# Altium schematic sheet Pulse.schdoc
size 594 x 419 mm; Symbol: Drawing-Symbol_A4; Company: 嘉立创EDA; Version: V1.0; Page Size: A2; @Project Name: hackathon; @Update Date: 2026-08-20; @Create Date: 2026-08-20; Device: Drawing-Symbol_A4; @Board Name: Board1; @Page Name: P1; @Create Time: 20:05:00; @Page Count: 1; @Page No: 1; @Schematic Name: Schematic1; @Update Time: 20:05:00; @Assembly Variant: Basic; Border: 1; Title Block Position: 3; Size: A4; Width: 2338; Height: 1652; Region Start: 1; X Region Count: 6; Y Region Count: 4; Blade Width: 10
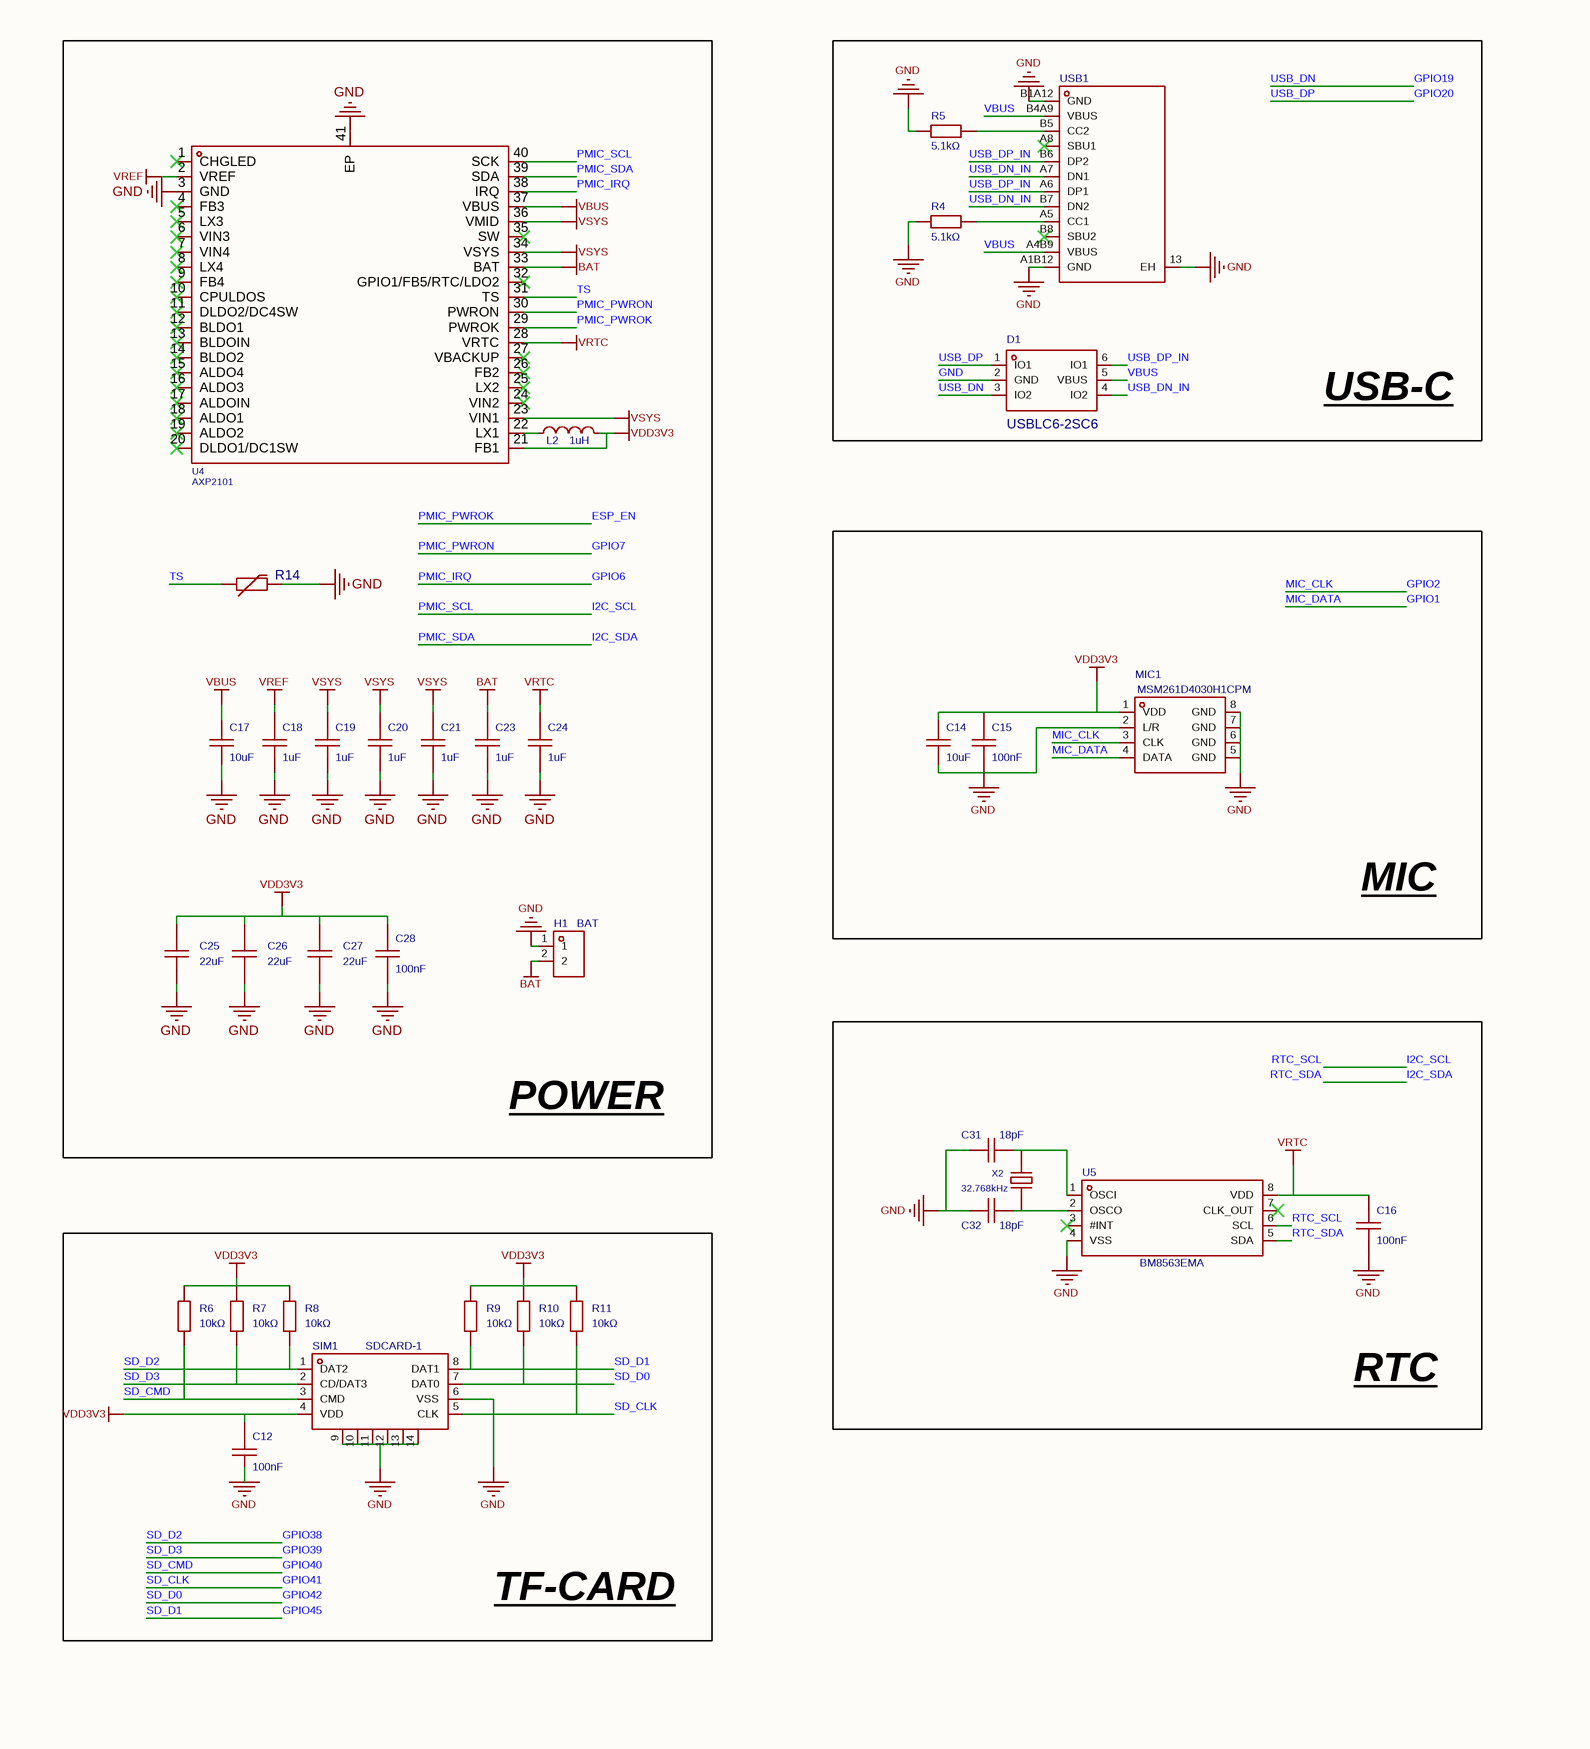
[diagram p0: Pulse.schdoc, left]
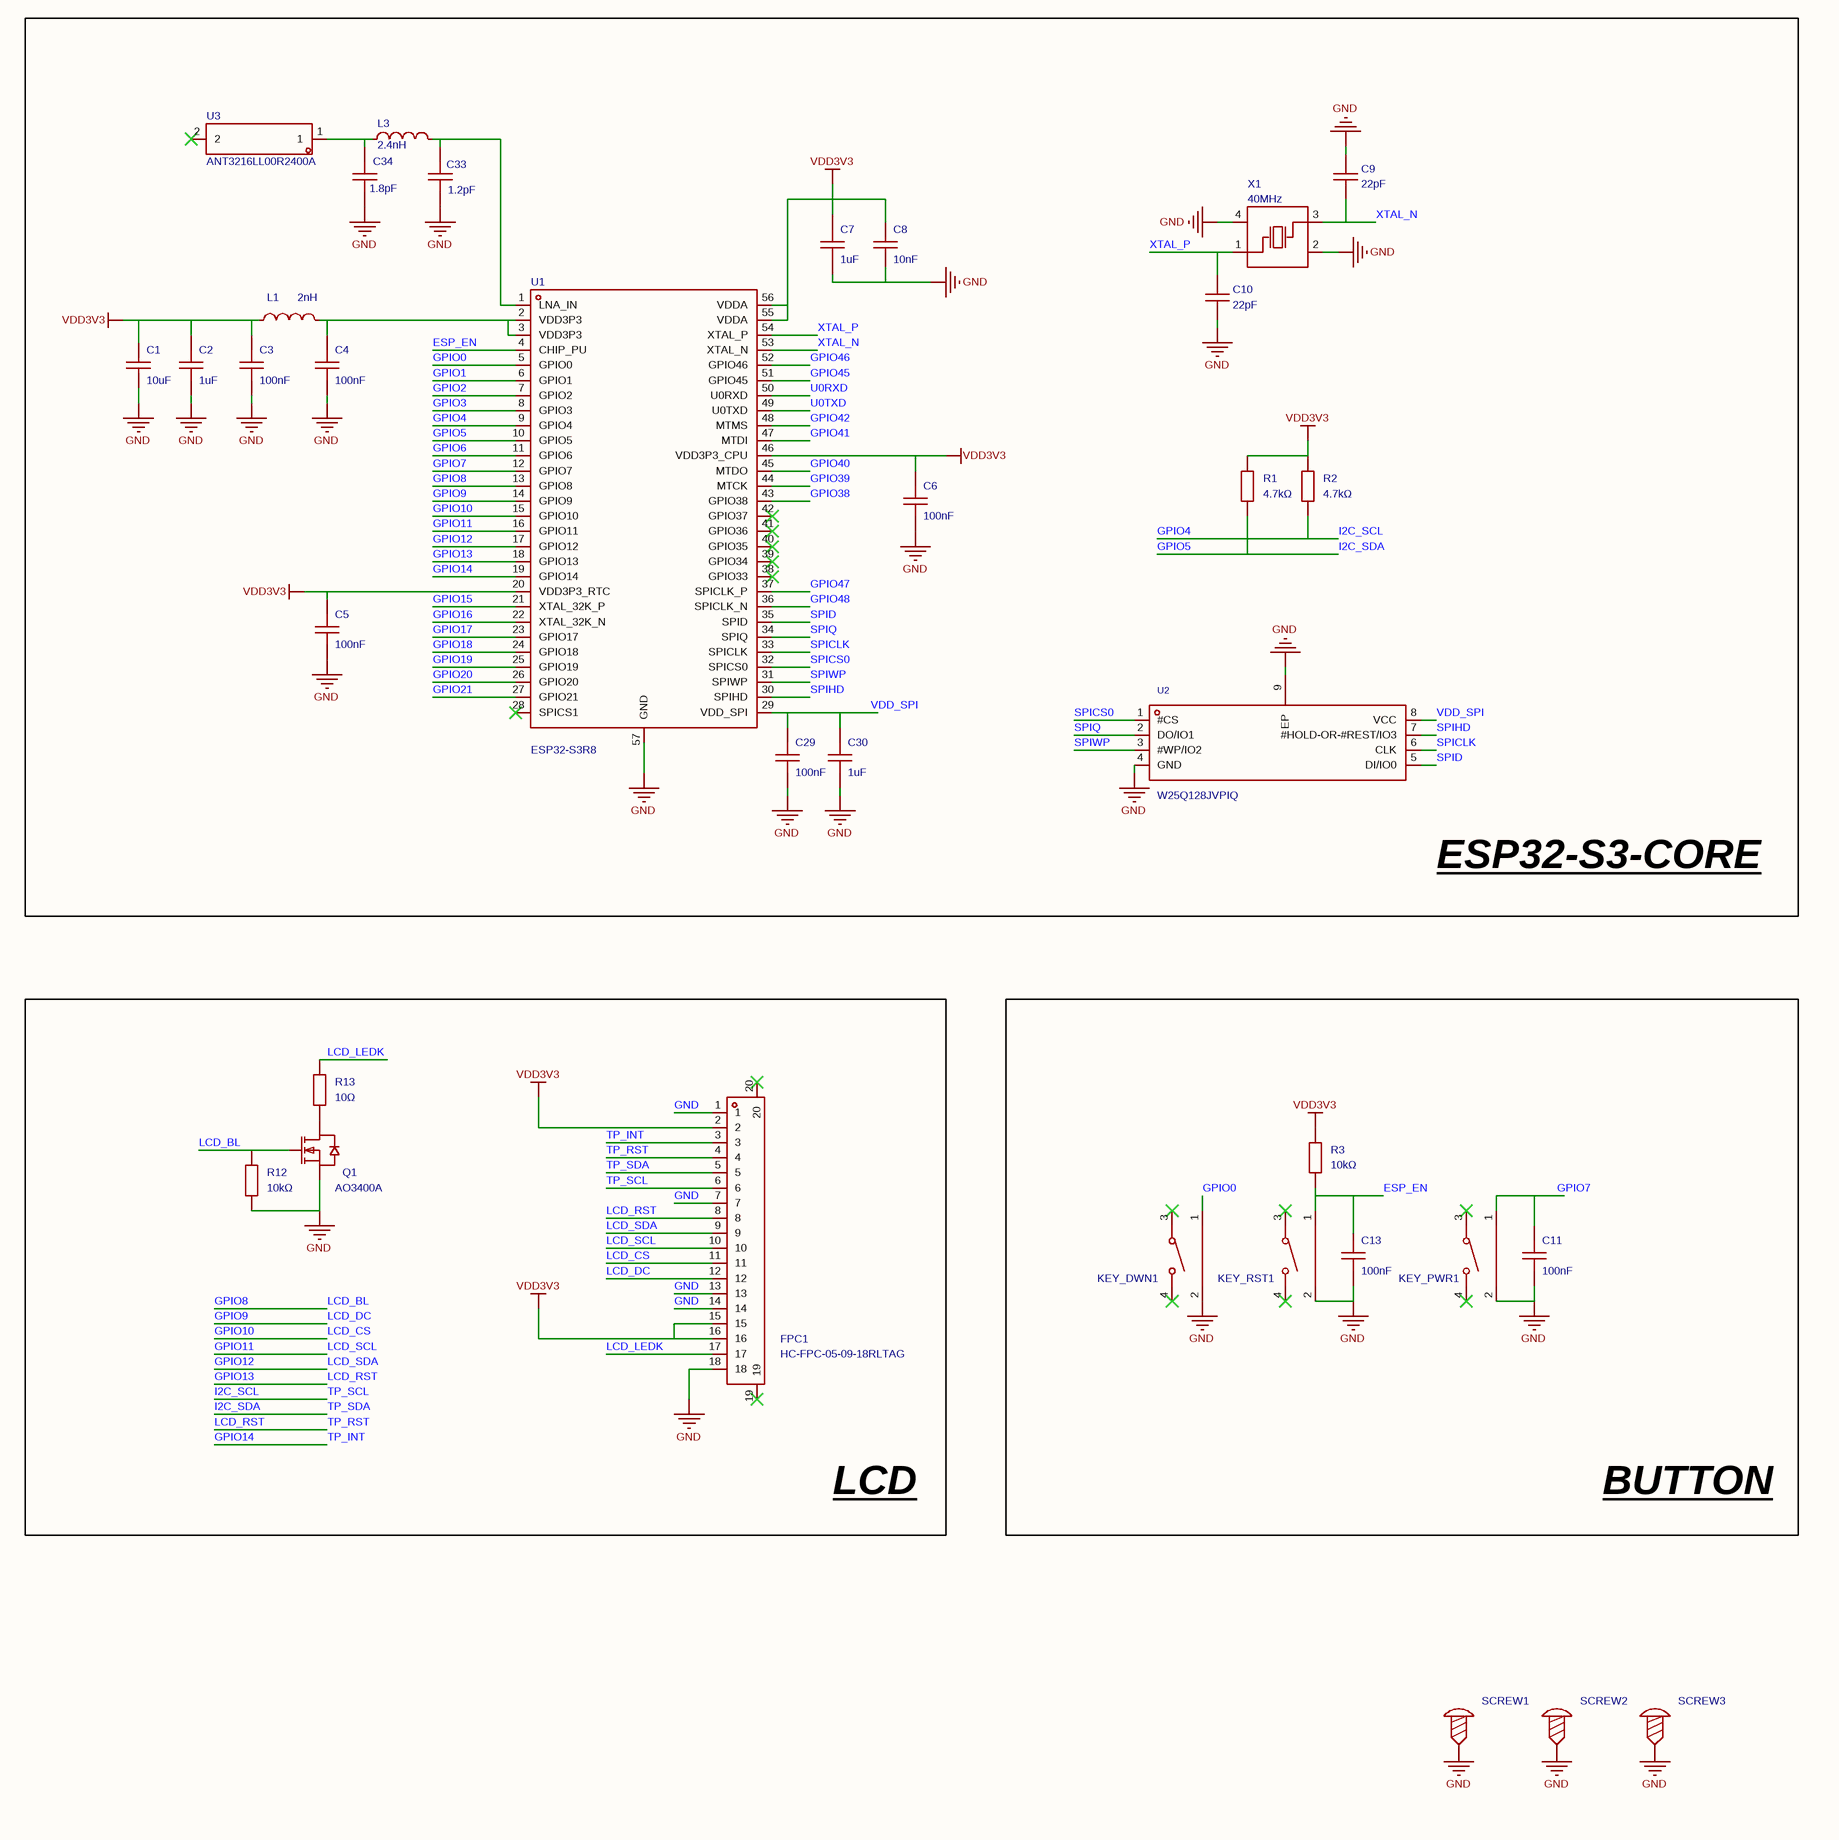
[diagram p1: Pulse.schdoc, right]

## Parts
C1  10uF  [C0402]
C2  1uF  [C0402]
C3  100nF  [C0402]
C4  100nF  [C0402]
C5  100nF  [C0402]
C6  100nF  [C0402]
C7  1uF  [C0402]
C8  10nF  [C0402]
C9  22pF  [C0402]
C10  22pF  [C0402]
C11  100nF  [C0402]
C12  100nF  [C0402]
C13  100nF  [C0402]
C14  10uF  [C0402]
C15  100nF  [C0402]
C16  100nF  [C0402]
C17  10uF  [C0402]
C18  1uF  [C0402]
C19  1uF  [C0402]
C20  1uF  [C0402]
C21  1uF  [C0402]
C23  1uF  [C0402]
C24  1uF  [C0402]
C25  22uF  [C0603]
C26  22uF  [C0603]
C27  22uF  [C0603]
C28  100nF  [C0402]
C29  100nF  [C0402]
C30  1uF  [C0402]
C31  18pF  [C0402]
C32  18pF  [C0402]
C33  1.2pF  [C0201]
C34  1.8pF  [C0201]
D1  (no value)  [SOT-23-6_L2.9-W1.6-P0.95-LS2.8-BL]
FPC1  HC-FPC-05-09-18RLTAG  [FPC-SMD_18P-P0.50_HC-FPC-05-09-18RLTAG]
H1  BAT  [HDR-TH_2P-P2.54-V-M]
KEY_DWN1  TS24CA  [SW-SMD_TS24CA]  (value not drawn)
KEY_PWR1  TS24CA  [SW-SMD_TS24CA]  (value not drawn)
KEY_RST1  TS24CA  [SW-SMD_TS24CA]  (value not drawn)
L1  2nH  [L0402]
L2  1uH  [IND-SMD_L2.5-W2.0_WPN252012H]
L3  2.4nH  [L0201]
MIC1  MSM261D4030H1CPM  [MIC-SMD_8P-L4.0-W3.0_ZTS6231]
Q1  AO3400A  [SOT-23-3_L2.9-W1.3-P1.90-LS2.4-BR]
R1  4.7kΩ  [R0402]
R2  4.7kΩ  [R0402]
R3  10kΩ  [R0402]
R4  value 5.1kΩ  [R0402]
R5  value 5.1kΩ  [R0402]
R6  10kΩ  [R0402]
R7  10kΩ  [R0402]
R8  10kΩ  [R0402]
R9  10kΩ  [R0402]
R10  10kΩ  [R0402]
R11  10kΩ  [R0402]
R12  10kΩ  [R0402]
R13  10Ω  [R0402]
R14  NCP18XH103F03RB  [R0603]  (value not drawn)
SCREW1  (no value)  [M1螺丝孔]
SCREW2  (no value)  [M1螺丝孔]
SCREW3  (no value)  [M1螺丝孔]
SIM1  SDCARD-1  [SIM-SMD_8P-1040310811]
U1  ESP32-S3R8  [QFN-56_L7.0-W7.0-P0.40-TL-EP4.0]
U2  W25Q128JVPIQ  [WSON-8_L6.0-W5.0-P1.27-BL-EP]
U3  ANT3216LL00R2400A  [ANT-SMD_L3.2-W1.6]
U4  AXP2101  [QFN-40_L5.0-W5.0-P0.40-TL-EP3.4]
U5  BM8563EMA  [MSOP-8_L3.0-W3.0-P0.65-LS5.0-BL]
USB1  MC-121-L119  [USB-C-SMD_HANBO_MC-121-L119]  (value not drawn)
X1  40MHz  [OSC-SMD_4P-L3.2-W2.5-BL_SIT8008BI]
X2  32.768kHz  [CRYSTAL-SMD_L3.2-W1.5-1]

## Blocks framed on the sheet
POWER: C17-C21 C23-C28 H1 L2 R14 U4
USB-C: D1 R4 R5 USB1
ESP32-S3-CORE: C1-C10 C29 C30 C33 C34 L1 L3 R1 R2 U1-U3 X1
MIC: C14 C15 MIC1
RTC: C16 C31 C32 U5 X2
LCD: FPC1 Q1 R12 R13
BUTTON: C11 C13 KEY_DWN1 KEY_PWR1 KEY_RST1 R3
TF-CARD: C12 R6-R11 SIM1

## Nets
BAT: C23.2 H1.2 U4.33(BAT)
GND: C1.1 C2.1 C3.1 C4.1 C5.1 C6.1 C7.1 C8.1 C9.2 C10.1 C11.1 C12.1 C13.1 C14.1 C15.1 C16.1 C17.1 C18.1 C19.1 C20.1 C21.1 C23.1 C24.1 C25.1 C26.1 C27.1 C28.1 C29.1 C30.1 C31.1 C32.1 C33.1 C34.1 D1.2(GND) FPC1.1 FPC1.7 FPC1.13 FPC1.14 FPC1.18 H1.1 KEY_DWN1.2 KEY_PWR1.2 KEY_RST1.2 MIC1.2(L/R) MIC1.5(GND) MIC1.6(GND) MIC1.7(GND) MIC1.8(GND) Q1.2(S) R4.2 R5.2 R12.1 R14.1 SCREW1.1 SCREW2.1 SCREW3.1 SIM1.6(VSS) SIM1.9 SIM1.10 SIM1.11 SIM1.12 SIM1.13 SIM1.14 U1.57(GND) U2.4(GND) U2.9(EP) U4.3(GND) U4.41(EP) U5.4(VSS) USB1.13(EH) USB1.A1B12(GND) USB1.B1A12(GND) X1.2(GND) X1.4(GND)
VBUS: C17.2 D1.5(VBUS) U4.37(VBUS) USB1.A4B9(VBUS) USB1.B4A9(VBUS)
VDD3V3: C1.2 C2.2 C3.2 C5.2 C6.2 C7.2 C8.2 C12.2 C14.2 C15.2 C25.2 C26.2 C27.2 C28.2 FPC1.2 FPC1.15 FPC1.16 L1.1 L2.2 MIC1.1(VDD) R1.2 R2.2 R3.2 R6.2 R7.2 R8.2 R9.2 R10.2 R11.2 SIM1.4(VDD) U1.20(VDD3P3_RTC) U1.46(VDD3P3_CPU) U1.55(VDDA) U1.56(VDDA) U4.21(FB1)
VREF: C18.2 U4.2(VREF)
VRTC: C16.2 C24.2 U4.28(VRTC) U5.8(VDD)
VSYS: C19.2 C20.2 C21.2 U4.23(VIN1) U4.34(VSYS) U4.36(VMID)
ESP_EN: C13.2 KEY_RST1.1 R3.1 U1.4(CHIP_PU) U4.29(PWROK)  [also labelled PMIC_PWROK]
GPIO0: KEY_DWN1.1 U1.5(GPIO0)
GPIO1: MIC1.4(DATA) U1.6(GPIO1)  [also labelled MIC_DATA]
GPIO2: MIC1.3(CLK) U1.7(GPIO2)  [also labelled MIC_CLK]
GPIO3: U1.8(GPIO3)
GPIO4: FPC1.6 R2.1 U1.9(GPIO4) U4.40(SCK) U5.6(SCL)  [also labelled I2C_SCL, PMIC_SCL, RTC_SCL, TP_SCL]
GPIO5: FPC1.5 R1.1 U1.10(GPIO5) U4.39(SDA) U5.5(SDA)  [also labelled I2C_SDA, PMIC_SDA, RTC_SDA, TP_SDA]
GPIO6: U1.11(GPIO6) U4.38(IRQ)  [also labelled PMIC_IRQ]
GPIO7: C11.2 KEY_PWR1.1 U1.12(GPIO7) U4.30(PWRON)  [also labelled PMIC_PWRON]
GPIO8: Q1.1(G) R12.2 U1.13(GPIO8)  [also labelled LCD_BL]
GPIO9: FPC1.12 U1.14(GPIO9)  [also labelled LCD_DC]
GPIO10: FPC1.11 U1.15(GPIO10)  [also labelled LCD_CS]
GPIO11: FPC1.10 U1.16(GPIO11)  [also labelled LCD_SCL]
GPIO12: FPC1.9 U1.17(GPIO12)  [also labelled LCD_SDA]
GPIO13: FPC1.4 FPC1.8 U1.18(GPIO13)  [also labelled LCD_RST, TP_RST]
GPIO14: FPC1.3 U1.19(GPIO14)  [also labelled TP_INT]
GPIO15: U1.21(XTAL_32K_P)
GPIO16: U1.22(XTAL_32K_N)
GPIO17: U1.23(GPIO17)
GPIO18: U1.24(GPIO18)
GPIO19: D1.3(IO2) U1.25(GPIO19)  [also labelled USB_DN]
GPIO20: D1.1(IO1) U1.26(GPIO20)  [also labelled USB_DP]
GPIO21: U1.27(GPIO21)
GPIO38: R8.1 SIM1.1(DAT2) U1.43(GPIO38)  [also labelled SD_D2]
GPIO39: R7.1 SIM1.2(CD/DAT3) U1.44(MTCK)  [also labelled SD_D3]
GPIO40: R6.1 SIM1.3(CMD) U1.45(MTDO)  [also labelled SD_CMD]
GPIO41: R11.1 SIM1.5(CLK) U1.47(MTDI)  [also labelled SD_CLK]
GPIO42: R10.1 SIM1.7(DAT0) U1.48(MTMS)  [also labelled SD_D0]
GPIO45: R9.1 SIM1.8(DAT1) U1.51(GPIO45)  [also labelled SD_D1]
GPIO46: U1.52(GPIO46)
GPIO47: U1.37(SPICLK_P)
GPIO48: U1.36(SPICLK_N)
LCD_LEDK: FPC1.17 R13.2
SPICLK: U1.33(SPICLK) U2.6(CLK)
SPICS0: U1.32(SPICS0) U2.1(#CS)
SPID: U1.35(SPID) U2.5(DI/IO0)
SPIHD: U1.30(SPIHD) U2.7(#HOLD-OR-#REST/IO3)
SPIQ: U1.34(SPIQ) U2.2(DO/IO1)
SPIWP: U1.31(SPIWP) U2.3(#WP/IO2)
TS: R14.2 U4.31(TS)
U0RXD: U1.50(U0RXD)
U0TXD: U1.49(U0TXD)
USB_DN_IN: D1.4(IO2) USB1.A7(DN1) USB1.B7(DN2)
USB_DP_IN: D1.6(IO1) USB1.A6(DP1) USB1.B6(DP2)
VDD_SPI: C29.2 C30.2 U1.29(VDD_SPI) U2.8(VCC)
XTAL_N: C9.1 U1.53(XTAL_N) X1.3(OSC2)
XTAL_P: C10.2 U1.54(XTAL_P) X1.1(OSC1)
NetC4_2: C4.2 L1.2 U1.2(VDD3P3) U1.3(VDD3P3)
NetC31_2: C31.2 U5.1(OSCI) X2.2
NetC32_2: C32.2 U5.2(OSCO) X2.1
NetC33_2: C33.2 L3.2 U1.1(LNA_IN)
NetC34_2: C34.2 L3.1 U3.1
NetL2_1: L2.1 U4.22(LX1)
NetQ1_3: Q1.3(D) R13.1
NetR4_1: R4.1 USB1.A5(CC1)
NetR5_1: R5.1 USB1.B5(CC2)

Not connected (* = marked no-connect by the designer): FPC1 19* 20*; KEY_DWN1 3* 4*; KEY_PWR1 3* 4*; KEY_RST1 3* 4*; U1 28(SPICS1)* 38(GPIO33)* 39(GPIO34)* 40(GPIO35)* 41(GPIO36)* 42(GPIO37)*; U3 2*; U4 1(CHGLED)* 4(FB3)* 5(LX3)* 6(VIN3)* 7(VIN4)* 8(LX4)* 9(FB4)* 10(CPULDOS)* 11(DLDO2/DC4SW)* 12(BLDO1)* 13(BLDOIN)* 14(BLDO2)* 15(ALDO4)* 16(ALDO3)* 17(ALDOIN)* 18(ALDO1)* 19(ALDO2)* 20(DLDO1/DC1SW)* 24(VIN2)* 25(LX2)* 26(FB2)* 27(VBACKUP)* 32(GPIO1/FB5/RTC/LDO2)* 35(SW)*; U5 3(#INT)* 7(CLK_OUT)*; USB1 A8(SBU1)* B8(SBU2)*

## Notes on the sheet
- 创建日期
- 2026-08-20
- 原理图
- 板子
- Schematic1
- Board1
- 更新日期
- 图页
- P1
- 绘制
- 审阅
- hackathon
- 版本
- V1.0
- 尺寸
- A2
- 页    1    共    1
- 嘉立创EDA

## Library data of the parts
C1 C14 C17 = CL05A106MQ5NUNC: 容值:10uF;精度:±20%;额定电压:6.3V;材质(温度系数):X5R;; Manufacturer: SAMSUNG(三星); 3D Model: 36a51122f27c49738f86b3bfa98863e0; 3D Model Transform: 39.37,19.685,0,0,0,0,0,0,0; Tolerance: ±20%; Voltage Rated: 6.3V; Temperature Coefficient: X5R; AddInBom: yes; ModelName: C0402_L1.0-W0.5-H0.5; Symbol: CL05A106MQ5NUNC; Device: CL05A106MQ5NUNC; Value: 10uF; LCSC Part Name: 10uF ±20% 6.3V; Supplier Part: C15525; Manufacturer Part: CL05A106MQ5NUNC; Supplier Footprint: 0402; JLCPCB Part Class: 基础库; Datasheet: https://atta.szlcsc.com/upload/public/pdf/source/20220823/2B02EE04F8F211D38A52DCB16EB6BEBA.pdf; Supplier: LCSC; ConvertToPcb: yes; FootprintName: C0402
C2 C7 C18-C21 C23 C24 C30 = CL05A105KA5NQNC: 容值:1uF;精度:±10%;额定电压:25V;材质(温度系数):X5R;; Manufacturer: SAMSUNG(三星); 3D Model: 36a51122f27c49738f86b3bfa98863e0; 3D Model Transform: 39.37,19.685,0,0,0,0,0,0,0; Tolerance: ±10%; Voltage Rated: 25V; Temperature Coefficient: X5R; AddInBom: yes; ModelName: C0402_L1.0-W0.5-H0.5; Symbol: CL05A105KA5NQNC; Device: CL05A105KA5NQNC; Value: 1uF; LCSC Part Name: 1uF ±10% 25V; Supplier Part: C52923; Manufacturer Part: CL05A105KA5NQNC; Supplier Footprint: 0402; JLCPCB Part Class: 基础库; Datasheet: https://atta.szlcsc.com/upload/public/pdf/source/20160103/1457707735223.pdf; Supplier: LCSC; ConvertToPcb: yes; FootprintName: C0402
C3-C6 C11-C13 C15 C16 C28 C29 = CL05B104KO5NNNC: 容值:100nF;精度:±10%;额定电压:16V;材质(温度系数):X7R;; Manufacturer: SAMSUNG(三星); 3D Model: 36a51122f27c49738f86b3bfa98863e0; 3D Model Transform: 39.37,19.685,0,0,0,0,0,0,0; Tolerance: ±10%; Voltage Rated: 16V; Temperature Coefficient: X7R; AddInBom: yes; ModelName: C0402_L1.0-W0.5-H0.5; Symbol: CL05B104KO5NNNC; Device: CL05B104KO5NNNC; Value: 100nF; LCSC Part Name: 100nF ±10% 16V; Supplier Part: C1525; Manufacturer Part: CL05B104KO5NNNC; Supplier Footprint: 0402; JLCPCB Part Class: Basic Part; Datasheet: https://atta.szlcsc.com/upload/public/pdf/source/20160103/1457707674891.pdf; Supplier: LCSC; ConvertToPcb: yes; FootprintName: C0402
C8 = CL05B103KB5NNNC: 容值:10nF;精度:±10%;额定电压:50V;材质(温度系数):X7R;; Manufacturer: SAMSUNG(三星); 3D Model: 36a51122f27c49738f86b3bfa98863e0; 3D Model Transform: 39.37,19.685,0,0,0,0,0,0,0; Tolerance: ±10%; Voltage Rated: 50V; Temperature Coefficient: X7R; AddInBom: yes; ModelName: C0402_L1.0-W0.5-H0.5; Symbol: CL05B103KB5NNNC; Device: CL05B103KB5NNNC; Value: 10nF; LCSC Part Name: 10nF ±10% 50V; Supplier Part: C15195; Manufacturer Part: CL05B103KB5NNNC; Supplier Footprint: 0402; JLCPCB Part Class: 基础库; Datasheet: https://atta.szlcsc.com/upload/public/pdf/source/20160103/1457707674468.pdf; Supplier: LCSC; ConvertToPcb: yes; FootprintName: C0402
C9 C10 = 0402CG220J500NT: 容值:22pF;精度:±5%;额定电压:50V;温度系数:C0G;; Manufacturer: FH(风华); 3D Model: 36a51122f27c49738f86b3bfa98863e0; 3D Model Transform: 39.37,19.685,0,0,0,0,0,0,0; Tolerance: ±5%; Voltage Rated: 50V; Temperature Coefficient: C0G; AddInBom: yes; ModelName: C0402_L1.0-W0.5-H0.5; Symbol: 0402CG220J500NT; Device: 0402CG220J500NT; Value: 22pF; LCSC Part Name: 22pF ±5% 50V; Supplier Part: C1555; Manufacturer Part: 0402CG220J500NT; Supplier Footprint: 0402; JLCPCB Part Class: 基础库; Datasheet: https://atta.szlcsc.com/upload/public/pdf/source/20170923/C1555_1506149269156988362.pdf; Supplier: LCSC; ConvertToPcb: yes; FootprintName: C0402
C25-C27 = CL10A226MQ8NRNC: 容值:22uF;精度:±20%;额定电压:6.3V;温度系数:X5R;; Manufacturer: SAMSUNG(三星); AddInBom: yes; ModelId: ac125912035d415993ca9572d50418b10819f05c4eef4c71ace90d822a990e87; ModelName: C0603_L1.6-W0.8-H0.8; ModelTransform: 62.992,31.496,0,0,0,0,0,0,0; Tolerance: ±20%; Voltage Rating: 6.3V; Temperature Coefficient: X5R; Symbol: CL10A226MQ8NRNC; Device: CL10A226MQ8NRNC; LCSC Part Name: 22uF ±20% 6.3V; SupplierPart: C59461; ManufacturerPart: CL10A226MQ8NRNC; Supplier Footprint: 0603; JLCPCB Part Class: Basic Part; Datasheet: https://item.szlcsc.com/datasheet/CL10A226MQ8NRNC/60514.html; Supplier: LCSC; ConvertToPcb: yes; FootprintName: C0603; Value: 22uF
C31 C32 = 0402CG180J500NT: 容值:18pF;精度:±5%;额定电压:50V;材质(温度系数):C0G;; Manufacturer: FH(风华); 3D Model: 36a51122f27c49738f86b3bfa98863e0; 3D Model Transform: 39.37,19.685,0,0,0,0,0,0,0; Tolerance: ±5%; Voltage Rated: 50V; Temperature Coefficient: C0G; AddInBom: yes; ModelName: C0402_L1.0-W0.5-H0.5; Symbol: 0402CG180J500NT; Device: 0402CG180J500NT; Value: 18pF; LCSC Part Name: 18pF ±5% 50V; Supplier Part: C1549; Manufacturer Part: 0402CG180J500NT; Supplier Footprint: 0402; JLCPCB Part Class: 基础库; Datasheet: https://atta.szlcsc.com/upload/public/pdf/source/20170923/C1549_1506149266585988356.pdf; Supplier: LCSC; ConvertToPcb: yes; FootprintName: C0402
C33 = GJM0335C1H1R2BB01D: 容值:1.2pF;额定电压:50V;材质(温度系数):C0G;; Manufacturer: muRata(村田); 3D Model: e8033a7cb35143ffb28e3b81b2577ea0; 3D Model Transform: 23.622,11.811,0,0,0,0,0,0,0; Voltage Rated: 50V; Temperature Coefficient: C0G; AddInBom: yes; ModelName: C0201_L0.6-W0.3-H0.3; Symbol: GJM0335C1H1R2BB01D; Device: GJM0335C1H1R2BB01D; LCSC Part Name: 1.2pF 50V; Supplier Footprint: 0201; JLCPCB Part Class: Extended Part; Datasheet: https://atta.szlcsc.com/upload/public/pdf/source/20190904/C426118_85E81C7C1F21FC87C5FB6D536E0847B4.pdf; SupplierPart: C415409; ManufacturerPart: GJM0335C1H1R2BB01D; Supplier: LCSC; ConvertToPcb: yes; FootprintName: C0201; Value: 1.2pF
C34 = GRM0335C1H1R8BA01D: 容值:1.8pF;额定电压:50V;材质(温度系数):C0G;; Manufacturer: muRata(村田); 3D Model: e8033a7cb35143ffb28e3b81b2577ea0; 3D Model Transform: 23.622,11.811,0,0,0,0,0,0,0; Voltage Rated: 50V; Temperature Coefficient: C0G; AddInBom: yes; ModelName: C0201_L0.6-W0.3-H0.3; Symbol: GRM0335C1H1R8BA01D; Device: GRM0335C1H1R8BA01D; LCSC Part Name: 1.8pF 50V ±0.1pF; Supplier Footprint: 0201; Datasheet: https://atta.szlcsc.com/upload/public/pdf/source/20200305/C490387_23319AE8C154DEB24C505E6C82A8106A.pdf; SupplierPart: C161415; ManufacturerPart: GRM0335C1H1R8BA01D; JLCPCB Part Class: 扩展库; Supplier: LCSC; ConvertToPcb: yes; FootprintName: C0201; Value: 1.8pF
D1 = USBLC6-2SC6: 极性:-;反向关断电压（典型值）:-;击穿电压（最小值）:-;箝位电压:-;峰值脉冲电流（10/1000us）:-;; Manufacturer: TECH PUBLIC(台舟); Symbol: USBLC6-2SC6_C2827654; 3D Model: 18da8f6c14a34920b3e136b5c401a119; 3D Model Transform: 110.236,113.364,0,90,0,0,0.0005,0.0005,0; AddInBom: yes; ModelName: SOT-23-6_L2.9-W1.6-H1.5-LS2.8-P0.95; Device: USBLC6-2SC6; LCSC Part Name: USBLC6-2SC6; Supplier Part: C2827654; Manufacturer Part: USBLC6-2SC6; Supplier Footprint: SOT-23-6; JLCPCB Part Class: Extended Part; Datasheet: https://atta.szlcsc.com/upload/public/pdf/source/20210810/FBD75DE717D6D97BAC6DD7F2B5C09DCD.pdf; Supplier: LCSC; Polarity: -; Voltage - Reverse Standoff (Typ): -; Voltage - Breakdown (Min): -; Voltage - Clamping (Max) @ Ipp: -; Current - Peak Pulse (10/1000μs): -; ConvertToPcb: yes; FootprintName: SOT-23-6_L2.9-W1.6-P0.95-LS2.8-BL
FPC1 = HC-FPC-05-09-18RLTAG: 锁定特性:翻盖式;触点类型:双侧触点/上下接;触点数量:18P;间距:0.5mm;安装类型:卧贴;工作温度范围:-55℃~+85℃;; Manufacturer: HCTL(华灿天禄); 3D Model: 73d1f367ef364801854ae7ee9221bcfc; 3D Model Transform: 433.464,137.795,0,0,0,0,0,7.008,0; Locking Feature: 翻盖式; Number of Contacts: 18P; Pitch: 0.5mm; FFC, FCB Thickness: 0.3mm; AddInBom: yes; Symbol: HC-FPC-05-09-18RLTAG; Device: HC-FPC-05-09-18RLTAG; LCSC Part Name: 翻盖式 双侧触点/上下接 P数:18P 间距:0.5mm; Supplier Part: C5213754; Manufacturer Part: HC-FPC-05-09-18RLTAG; Supplier Footprint: SMD,P=0.5mm,卧贴; JLCPCB Part Class: 扩展库; Datasheet: https://atta.szlcsc.com/upload/public/pdf/source/20221026/52A26161A88FCE07A06989F8D4399614.pdf; Supplier: LCSC; Contact Type: 双侧触点/上下接; Mounting Type: 卧贴; Height Above Board: 1mm; Contact Material: 铜合金; Operating Temperature Range: -55℃~+85℃; ConvertToPcb: yes; FootprintName: FPC-SMD_18P-P0.50_HC-FPC-05-09-18RLTAG; ModelName: FPC-SMD_18P-P0.50_HC-FPC-05-09-18RLTAG
H1 = PZ254V-11-02P: 排数:单排;总PIN位数:2P;间距:2.54mm;插针结构:1x2P;行距:-;安装类型:直插;圆针/方针:方针;额定电流:-;额定电压:-;配合针长度:6mm;塑高:2.5mm;端接针长度:3mm;触头材质:黄铜;触头镀层:-;工作温度范围:-40℃~+105℃;颜色:黑色;; Manufacturer: XFCN(兴飞); Add into BOM: no; 3D Model: e35305ec3aa84b66b849f914b715e73f; 3D Model Transform: 200,100,0,0,0,0,0,0,-118.11; Pitch: 2.54mm; Pin Structure: 1x2P; Circluar Pins/Square Pins: 方针; ModelName: HDR2.54-M-LI-1X2P; Symbol: PZ254V-11-02P; Device: PZ254V-11-02P; Convert to PCB: no; LCSC Part Name: 2.54mm 1x2P 直插 方针; Supplier Footprint: 插件,P=2.54mm; Datasheet: https://atta.szlcsc.com/upload/public/pdf/source/20200309/C492401_A812433581A9B211A7FFA413ADDFF0E5.pdf; Number of Rows: 单排; Number of Pins: 2P; Row Spacing: -; Mounting Type: 直插; Current Rating (Max): -; Voltage Rating (Max): -; Length of Mating Pin: 6mm; Insulation Height: 2.5mm; Length of End Connection Pin: 3mm; Contact Material: 黄铜; Contact Plating: -; Operating Temperature Range: -40℃~+105℃; Color: 黑色; Manufacturer Part: BAT; Supplier: LCSC; Supplier Part: C492401; JLCPCB Part Class: 扩展库; FootprintName: HDR-TH_2P-P2.54-V-M
KEY_DWN1 KEY_PWR1 KEY_RST1 = TS24CA: 触点电流:50mA;额定电压(DC):12V;电路结构:单刀单掷;安装方式:卧贴;带灯:-;机械寿命:-;; Manufacturer: SHOU HAN(首韩); 3D Model: b2de6e3973c24e28b5c55d180348ee9a; 3D Model Transform: 179.134,141.732,0,0,0,0,0.003,44.293,-15.748; Contact Current: 50mA; Voltage Rating (DC): 12V; Circuit: 单刀单掷; Actuator Style: 矩形按钮; Switch Length: 4.55mm; Switch Width: 1.8mm; Switch Height: 3.5mm; AddInBom: yes; Symbol: TS24CA; Device: TS24CA; LCSC Part Name: 4.55*1.8*3.5mm 卧贴 轻触开关; Supplier Part: C393942; Manufacturer Part: TS24CA; Supplier Footprint: SMD; JLCPCB Part Class: 扩展库; Datasheet: https://atta.szlcsc.com/upload/public/pdf/source/20190521/C393942_591A9E318887EFA4274D34029981AD99.pdf; Supplier: LCSC; Mounting Style: 卧贴; With Lamp: -; Mechanical Life: -; ConvertToPcb: yes; FootprintName: SW-SMD_TS24CA; ModelName: SW-SMD_TS24CA
L1 = LQG15HS2N0S02D: 电感值:2nH;精度:±0.3nH;额定电流:900mA;饱和电流(Isat):-;直流电阻(DCR):90mΩ;; Manufacturer: muRata(村田); 3D Model: d8d36575a3234d4790bfa765c88664a7; 3D Model Transform: 39.37,19.685,0,0,0,0,0,0.0005,0; Tolerance: ±0.3nH; Rated Current: 900mA; DC Resistance (DCR): 90mΩ; Q @ Freq: 8@100MHz; Frequency - Self Resonant: 6GHz; AddInBom: yes; ModelName: L0402_L1.0-W0.5-H0.5_BEAD; Symbol: LQG15HS2N0S02D; Device: LQG15HS2N0S02D; Value: 2nH; LCSC Part Name: 2nH ±0.3nH 900mA 90mΩ; Supplier Part: C18216; Manufacturer Part: LQG15HS2N0S02D; Supplier Footprint: 0402; JLCPCB Part Class: 扩展库; Datasheet: https://atta.szlcsc.com/upload/public/pdf/source/20190514/C18216_4C6D770518CF7A3B206943E09D2940CE.pdf; Supplier: LCSC; Saturation Current (Isat): -; Ratings: -; ConvertToPcb: yes; FootprintName: L0402
L2 = WPN252012H1R0MT: 电感值:1uH;精度:±20%;额定电流:3A;饱和电流(Isat):4.2A;类型:-;; Manufacturer: Sunlord(顺络); 3D Model: 7ae8e774cfcf498ea5119a488d0de531; 3D Model Transform: 78.74,99.2124,0,90,0,0,0,0,0; Tolerance: ±20%; Rated Current: 3A; Saturation Current (Isat): 4.2A; DC Resistance (DCR): 54mΩ; AddInBom: yes; ModelName: IND-SMD_L2.5-W2.0-H1.2-252012; Symbol: WPN252012H1R0MT; Device: WPN252012H1R0MT; LCSC Part Name: 1uH ±20% 4.2A; Supplier Part: C98348; Manufacturer Part: WPN252012H1R0MT; Supplier Footprint: 1008; JLCPCB Part Class: 扩展库; Datasheet: https://atta.szlcsc.com/upload/public/pdf/source/20231024/AA72387348CB63159A6CBE41DDE5ECDA.pdf; Supplier: LCSC; Value: 1uH; Type: -; Ratings: -; ConvertToPcb: yes; FootprintName: IND-SMD_L2.5-W2.0_WPN252012H
L3 = LQP03TN2N4B02D: 电感值:2.4nH;精度:-;额定电流:500mA;饱和电流(Isat):-;直流电阻(DCR):200mΩ;; Manufacturer: muRata(村田); 3D Model: 62bef5db133646c7914ab8b9bdc86b60; 3D Model Transform: 23.622,11.811,0,0,0,0,0,0,0; Rated Current: 500mA; DC Resistance (DCR): 200mΩ; Q @ Freq: 14@500MHz; Frequency - Self Resonant: 10GHz; AddInBom: yes; ModelName: L0201-RD; Symbol: LQP03TN2N4B02D; Device: LQP03TN2N4B02D; LCSC Part Name: 2.4nH; Supplier Footprint: 0201; Datasheet: https://atta.szlcsc.com/upload/public/pdf/source/20200107/C157592_7FF58F85BAEF0D918ADFA12AEC0AEBA8.pdf; Tolerance: -; Saturation Current (Isat): -; Ratings: -; SupplierPart: C98042; ManufacturerPart: LQP03TN2N4B02D; JLCPCB Part Class: 扩展库; Supplier: LCSC; ConvertToPcb: yes; FootprintName: L0201; Value: 2.4nH
MIC1 = MSM261D4030H1CPM: 方向:全指向;灵敏度:-26dB；-25dB;信噪比:64dB；62dB;电流消耗:670uA；290uA;电源电压:1.8V;阻抗:-;; Manufacturer: MEMS(敏芯微); 3D Model: eefd2b15c3cb4a068cddfd943ec11f00; 3D Model Transform: 118.11,157.48,0,0,0,0,-0.002,0,0; Direction: 全指向; Supply Voltage: 1.8V; AddInBom: yes; Symbol: MSM261D4030H1CPM; Device: MSM261D4030H1CPM; LCSC Part Name: MSM261D4030H1CPM; Supplier Part: C966942; Manufacturer Part: MSM261D4030H1CPM; Supplier Footprint: SMD,4x3x1mm; JLCPCB Part Class: 扩展库; Datasheet: https://atta.szlcsc.com/upload/public/pdf/source/20201204/C966942_B60AB8B480FB10DBF6E1564FEF312E24.pdf; Supplier: LCSC; Sensitivity: -26dB；-25dB; SNR(Signal to Noise Ratio): 64dB；62dB; Current Consumption: 670uA；290uA; Impedance: -; ConvertToPcb: yes; FootprintName: MIC-SMD_8P-L4.0-W3.0_ZTS6231; ModelName: MIC-SMD_8P-L4.0-W3.0_ZTS6231
Q1 = AO3400A_C347475: 类型:1个N沟道;漏源电压(Vdss):30V;连续漏极电流(Id):5.8A;功率(Pd):1.4W;导通电阻(RDS(on)@Vgs,Id):35mΩ@10V,5.8A;阈值电压(Vgs(th)@Id):1.4V@250uA;; Manufacturer: UMW(友台半导体); 3D Model: c62791f0466c4ae2a892c056b845b0ca; 3D Model Transform: 98.425,114.173,0,180,0,0,0.0005,-0.0005,0; Type: 1个N沟道; Drain Source Voltage (Vdss): 30V; Power Dissipation (Pd): 1.4W; Total Gate Charge (Qg@Vgs): 12nC@4.5V; Input Capacitance (Ciss@Vds): 1.05nF@15V; AddInBom: yes; ModelName: SOT-23-3P_L2.9-W1.3-H1.0-LS2.4-P0.95; Symbol: AO3400A_C347475; Device: AO3400A_C347475; LCSC Part Name: 1个N沟道 耐压:30V 电流:5.8A; Supplier Part: C347475; Manufacturer Part: AO3400A; Supplier Footprint: SOT-23; JLCPCB Part Class: 扩展库; Datasheet: https://atta.szlcsc.com/upload/public/pdf/source/20231109/50AB4FB4D66E55864F9B8D027B723C9A.pdf; Supplier: LCSC; Continuous Drain Current (Id): 5.8A; Drain Source On Resistance (RDS(on)@Vgs,Id): 35mΩ@10V,5.8A; Gate Threshold Voltage (Vgs(th)@Id): 1.4V@250uA; Reverse Transfer Capacitance (Crss@Vds): -; Operating Temperature: -55℃~+150℃@(Tj); ConvertToPcb: yes; FootprintName: SOT-23-3_L2.9-W1.3-P1.90-LS2.4-BR
R1 R2 = 0402WGF2201TCE: 电阻类型:厚膜电阻;阻值:2.2kΩ;精度:±1%;功率:62.5mW;温度系数:±100ppm/℃;最大工作电压:50V;工作温度范围:-55℃~+155℃;; Manufacturer: UNI-ROYAL(厚声); 3D Model: 671aefced39d4c318694bba8bd8efd39; 3D Model Transform: 39.37,19.685,0,0,0,0,0,0.0005,0; Tolerance: ±1%; Power(Watts): 62.5mW; Overload Voltage (Max): 50V; AddInBom: yes; ModelName: R0402_L1.0-W0.5-H0.5; Symbol: 0402WGF2201TCE; Device: 0402WGF2201TCE; Value: 4.7kΩ; LCSC Part Name: 2.2kΩ ±1% 62.5mW; Manufacturer Part: 0402WGF2201TCE; Supplier Footprint: 0402; JLCPCB Part Class: 基础库; Datasheet: https://atta.szlcsc.com/upload/public/pdf/source/20200306/C422600_1E6D84923E4A46A82E41ADD87F860B5C.pdf; Supplier: LCSC; Type: 厚膜电阻; Temperature Coefficient: ±100ppm/℃; Operating Temperature Range: -55℃~+155℃; ConvertToPcb: yes; FootprintName: R0402
R3 R6-R12 = 0402WGF1002TCE: 电阻类型:厚膜电阻;阻值:10kΩ;精度:±1%;功率:62.5mW;工作电压:50V;温度系数:±100ppm/℃;; Manufacturer: UNI-ROYAL(厚声); AddInBom: yes; ModelId: 98c88bc2b9094f218f3a3e30a70127380819f05c4eef4c71ace90d822a990e87; ModelName: R0402_L1.0-W0.5-H0.4; ModelTransform: 39.37,19.685,0,0,0,0,0,0,0; Tolerance: ±1%; Power(Watts): 62.5mW; Voltage-Supply(Max): 50V; Symbol: 0402WGF1002TCE; Device: 0402WGF1002TCE; LCSC Part Name: 10kΩ ±1% 62.5mW 厚膜电阻; SupplierPart: C25744; ManufacturerPart: 0402WGF1002TCE; Supplier Footprint: 0402; JLCPCB Part Class: Basic Part; Datasheet: https://item.szlcsc.com/datasheet/0402WGF1002TCE/26487.html; Supplier: LCSC; ConvertToPcb: yes; FootprintName: R0402; Type: 厚膜电阻; Value: 10kΩ; Temperature Coefficient: ±100ppm/℃; Operating Temperature: -55℃~+155℃
R4 R5 = 0402WGF5101TCE: 电阻类型:厚膜电阻;阻值:5.1kΩ;精度:±1%;功率:1/16W;温度系数:±100ppm/;最大工作电压:50V;工作温度范围:-55~+155;; Manufacturer: UNI-ROYAL(厚声); 3D Model: 671aefced39d4c318694bba8bd8efd39; 3D Model Transform: 39.37,19.685,0,0,0,0,0,0.0005,0; Tolerance: ±1%; Power(Watts): 1/16W; Overload Voltage (Max): 50V; AddInBom: yes; ModelName: R0402_L1.0-W0.5-H0.5; Symbol: 0402WGF5101TCE; Device: 0402WGF5101TCE; Temperature Coefficient: ±100ppm/; Operating Temperature Range: -55~+155; LCSC Part Name: 5.1kΩ ±1% 1/16W; Supplier Part: C25905; Manufacturer Part: 0402WGF5101TCE; Supplier Footprint: 0402; JLCPCB Part Class: Basic Part; Datasheet: https://atta.szlcsc.com/upload/public/pdf/source/20200306/C422600_1E6D84923E4A46A82E41ADD87F860B5C.pdf; Supplier: LCSC; Type: 厚膜电阻; ConvertToPcb: yes; FootprintName: R0402; Voltage-Supply(Max): 50V; Operating Temperature: -55℃~+155℃
R13 = 0402WGF100JTCE: 电阻类型:厚膜电阻;阻值:10Ω;精度:±1%;功率:62.5mW;温度系数:±200ppm/℃;最大工作电压:50V;工作温度范围:-55℃~+155℃;; Manufacturer: UNI-ROYAL(厚声); 3D Model: 671aefced39d4c318694bba8bd8efd39; 3D Model Transform: 39.37,19.685,0,0,0,0,0,0.0005,0; Tolerance: ±1%; Power(Watts): 62.5mW; Overload Voltage (Max): 50V; AddInBom: yes; ModelName: R0402_L1.0-W0.5-H0.5; Symbol: 0402WGF100JTCE; Device: 0402WGF100JTCE; LCSC Part Name: 10Ω ±1% 62.5mW; Value: 10Ω; Supplier Part: C25077; Manufacturer Part: 0402WGF100JTCE; Supplier Footprint: 0402; JLCPCB Part Class: 基础库; Datasheet: https://atta.szlcsc.com/upload/public/pdf/source/20200306/C422600_1E6D84923E4A46A82E41ADD87F860B5C.pdf; Supplier: LCSC; Type: 厚膜电阻; Temperature Coefficient: ±200ppm/℃; Operating Temperature Range: -55℃~+155℃; ConvertToPcb: yes; FootprintName: R0402
R14 = NCP18XH103F03RB: 阻值(25℃):10kΩ;B值(25℃/50℃):3380K;电阻精度:±1%;功率:100mW;B值精度:±1%;最大稳态电流(25℃):310uA;; Manufacturer: muRata(村田); 3D Model: fc143cca1e79419f9cd78b61e9279f08; 3D Model Transform: 31.8897,63.7794,0,90,0,0,0,0,0; Resistance @ 25℃: 10kΩ; B Constant (25℃/50℃): 3380K; Resistance Tolerance: ±1%; B Constant (25℃/85℃): 3434K; B Constant (25℃/100℃): 3455K; Power: 100mW; Steady State Current (Max): 310uA; AddInBom: yes; Symbol: NCP18XH103F03RB; Device: NCP18XH103F03RB; LCSC Part Name: 10kΩ 电阻精度:±1% 3380K; Supplier Footprint: 0603; Datasheet: https://atta.szlcsc.com/upload/public/pdf/source/20130819/1457706638081.pdf; B Constant (25℃/75℃): -; B Constant Tolerance: ±1%; Operating Temperature: -40℃~+125℃; SupplierPart: C13564; ManufacturerPart: NCP18XH103F03RB; JLCPCB Part Class: 扩展库; Supplier: LCSC; ConvertToPcb: yes; FootprintName: R0603; ModelName: R0603
SCREW1-SCREW3 = M2螺丝: Symbol: 螺丝孔; ConvertToPcb: yes; Device: M2螺丝; AddInBom: yes; Supplier Footprint: 插件; FootprintName: M1螺丝孔
SIM1 = 1040310811: 卡连接方式:拔插式;卡类型:MicroSD卡(TF卡);连接器类型:卡座;本体最大高度:1.42mm;触头镀层:金;工作温度范围:-;; Manufacturer: MOLEX; 3D Model: a759ed97f98247afac12575703a73216; 3D Model Transform: 470.472,448.818,0,0,0,0,0,-1.969,0; Card Connection Mode: 拔插式; Connector Type: 卡座; Maximum Body Height: 1.42mm; AddInBom: yes; Symbol: 1040310811; Device: 1040310811; LCSC Part Name: 拔插式 MicroSD卡(TF卡) 卡座; Supplier Part: C585350; Manufacturer Part: SDCARD-1; Supplier Footprint: SMD; JLCPCB Part Class: 扩展库; Datasheet: https://atta.szlcsc.com/upload/public/pdf/source/20201117/C585350_D1F0B30BD23514449186B2E50ACE8BBF.pdf; Supplier: LCSC; Card Type: MicroSD卡(TF卡); Contact Plating: 金; Operating Temperature Range: -; ConvertToPcb: yes; FootprintName: SIM-SMD_8P-1040310811; ModelName: SIM-SMD_8P-1040310811
U1 = ESP32-S3R8: 频率范围:2.412GHz~2.484GHz;接口类型:I2C；I2S；UART；USB；SPI;应用领域:蓝牙；WiFi;数据速率:150Mbps;灵敏度:-74.2dBm;典型应用频率:2.4GHz;; Manufacturer: ESPRESSIF(乐鑫); Symbol: ESP32-S3(R8); AddInBom: yes; ModelId: 105b388c0c03439aa7dbf35dd2b762a60819f05c4eef4c71ace90d822a990e87; ModelTransform: 275.59,275.59,0,0,0,0,0,0,0; Voltage - Supply: 3V~3.6V; Output Power: 18.5dBm; Current Of Transmitting: 283mA; Receive Current: 88mA; Typical Application Frequency: 2.4GHz; Device: ESP32-S3R8; LCSC Part Name: 不带固件 2.4GHz Wi-Fi + 低功耗蓝牙系统级芯片（SoC）; SupplierPart: C2913194; ManufacturerPart: ESP32-S3R8; Supplier Footprint: QFN-56(7x7); JLCPCB Part Class: Extended Part; Datasheet: https://item.szlcsc.com/datasheet/ESP32-S3R8/3198292.html; Supplier: LCSC; ConvertToPcb: yes; FootprintName: QFN-56_L7.0-W7.0-P0.40-TL-EP4.0; ModelName: QFN-56_L7.0-W7.0-P0.40-TL-EP4.0; Frequency Range: 2.412GHz~2.484GHz; Interface: I2C；I2S；UART；USB；SPI; Applications: 蓝牙；WiFi; Data Rate: 150Mbps; Sensitivity: -74.2dBm; Operating Temperature: -40℃~+65℃; Type: 收发器; Features: DMA功能
U2 = W25Q128JVPIQ_C190862: Manufacturer: WINBOND(华邦); Symbol: W25Q128JVPIQTR; 3D Model: 72347fabc1e24788a361efd6527ab939; 3D Model Transform: 237.007,196.85,0,90,0,0,0,0,0; AddInBom: yes; ModelName: WSON-8_L6.0-W5.0-H0.7-P1.27; Device: W25Q128JVPIQ_C190862; LCSC Part Name: W25Q128JVPIQ; Supplier Footprint: WSON-8-EP(5x6); Datasheet: https://atta.szlcsc.com/upload/public/pdf/source/20190705/C401662_06B6D416F67ED315879B366F63A3F7C9.pdf; SupplierPart: C190862; ManufacturerPart: W25Q128JVPIQ; JLCPCB Part Class: 扩展库; Supplier: LCSC; ConvertToPcb: yes; FootprintName: WSON-8_L6.0-W5.0-P1.27-BL-EP
U3 = ANT3216LL00R2400A: 2.4 - 2.5 GHz; Manufacturer: YAGEO(国巨); NO_CONNECT: yes; 3D Model: 7eb3a33db31f44a1a017d8a4ace7a401; 3D Model Transform: 126,63,0,180,0,0,0,0,0; ModelName: ANT-SMD_L3.2-W1.6-H1.3; Symbol: ANT3216LL00R2400A; Device: ANT3216LL00R2400A; Manufacturer Part: ANT3216LL00R2400A; LCSC Part Name: ANT3216LL00R2400A; Supplier Footprint: 1206; Datasheet: https://atta.szlcsc.com/upload/public/pdf/source/20181012/C293767_CDE82A2F74DC82A94DB708CB53B68F23.pdf; SupplierPart: C293767; JLCPCB Part Class: 扩展库; Supplier: LCSC; AddInBom: yes; ConvertToPcb: yes; FootprintName: ANT-SMD_L3.2-W1.6
U4 = AXP2101: A PMU designed by Allwinner; Manufacturer: x-powers; 3D Model: 49dd78c681fa4a93be92f4b2f5c46563; 3D Model Transform: 196.85,196.85,0,0,0,0,0,0,0; AddInBom: yes; ModelName: QFN-40_L5.0-W5.0-H0.9-P0.4-TL-EP; Symbol: AXP2101; Device: AXP2101; LCSC Part Name: AXP2101; Supplier Part: C3036461; Manufacturer Part: AXP2101; Supplier Footprint: QFN-40-EP(5x5); JLCPCB Part Class: 扩展库; Datasheet: https://atta.szlcsc.com/upload/public/pdf/source/20230506/27D868F447993329A9E953603DF31964.pdf; Supplier: LCSC; ConvertToPcb: yes; FootprintName: QFN-40_L5.0-W5.0-P0.40-TL-EP3.4
U5 = BM8563EMA: 低功耗CMOS实时时钟/日历芯片; Manufacturer: GATEMODE(捷茂微); 3D Model: bedc0aeebe0a475e87aaac88bd02a14b; 3D Model Transform: 196.85,118.11,0,90,0,0,0,0,0; AddInBom: yes; ModelName: MSOP-8_L3.0-W3.0-H1.1-LS4.9-P0.65; Symbol: BM8563EMA; Device: BM8563EMA; LCSC Part Name: BM8563EMA; Supplier Part: C269878; Manufacturer Part: BM8563EMA; Supplier Footprint: MSOP-8; JLCPCB Part Class: 扩展库; Datasheet: https://atta.szlcsc.com/upload/public/pdf/source/20180912/C269878_63AF37B959074677F199CFDDF2EA709F.pdf; Supplier: LCSC; ConvertToPcb: yes; FootprintName: MSOP-8_L3.0-W3.0-P0.65-LS5.0-BL
USB1 = MC-121-L119: 连接器类型:Type-C;协议标准:USB 3.1;公母:母;安装方式:卧贴;触点数量:16P;端口数量:1;额定电流 - 电源:5A;工作温度:-40℃~+85℃;; Manufacturer: HANBO(汉博); Add into BOM: yes; 3D Model: a6c47a182ba4405a9ddfcab7e651b5bc; 3D Model Transform: 351.9678,470.47146,0,0,0,0,0,-133.858,-35.433; Connector Type: Type-C; Gender: 母; Number of Contacts: 16P; Number of Ports: 1; Protocol Standard: USB 3.1; Current Rating-Power: 5A; Connect-Disconnect Life: 1万次; Center Height: 1.68mm; Symbol: MC-121-L119; Device: MC-121-L119; Convert to PCB: yes; LCSC Part Name: Type-C 母 卧贴; Supplier Part: C6332278; Manufacturer Part: MC-121-L119; Supplier Footprint: SMD; JLCPCB Part Class: Extended Part; Datasheet: https://item.szlcsc.com/datasheet/MC-121-L119/7280518.html; Supplier: LCSC; Mounting Type: 卧贴; Operating Temperature: -40℃~+85℃; FootprintName: USB-C-SMD_HANBO_MC-121-L119; ModelName: USB-C-SMD_HANBO_MC-121-L119
X1 = X322540MPB4SI: 晶振类型:贴片无源晶振;频率:40MHz;频率公差:±10ppm;频率稳定度:±30ppm;负载电容:15pF;工作温度:-40~+85;; Manufacturer: YXC(扬兴晶振); 3D Model: ae22b8d143894765bc8100c37cb6356f; 3D Model Transform: 125.984,98.425,0,0,0,0,0,0,0; Crystal Type: 贴片无源晶振; Frequency Tolerance: ±10ppm; Frequency Stability: ±30ppm; Load Capacitance: 15pF; AddInBom: yes; ModelName: OSC-SMD_4P-L3.2-W2.5-H1.0; Symbol: X322540MPB4SI; Device: X322540MPB4SI; Value: 40MHz; Operating Temperature: -40~+85; LCSC Part Name: 40MHz ±10ppm 15pF; Supplier Part: C9010; Manufacturer Part: X322540MPB4SI; Supplier Footprint: SMD3225-4P; JLCPCB Part Class: 扩展库; Datasheet: https://atta.szlcsc.com/upload/public/pdf/source/20210329/C112971_1F611BDC486E193C1706F6D8EB5AA189.pdf; Supplier: LCSC; ConvertToPcb: yes; FootprintName: OSC-SMD_4P-L3.2-W2.5-BL_SIT8008BI
X2 = FC-135 32.7680KA-AG3: 频率:32.768kHz;常温频差:±20ppm;负载电容:7pF;频率稳定度:-;; Manufacturer: EPSON(爱普生); AddInBom: yes; ModelId: 762d7afc596f4558a373612390f4386d0819f05c4eef4c71ace90d822a990e87; ModelTransform: 125.984,59.055,0,0,0,0,0,0,0; Normal temperature Frequency Tolerance: ±20ppm; Load Capacitance: 7pF; Equivalent Series Resistance(ESR): 70kΩ; Symbol: FC-135 32.7680KA-AG3; Device: FC-135 32.7680KA-AG3; LCSC Part Name: 32.768kHz ±20ppm 7pF; SupplierPart: C7275970; ManufacturerPart: FC-135 32.7680KA-AG3; Supplier Footprint: SMD3215-2P; JLCPCB Part Class: Extended Part; Datasheet: https://item.szlcsc.com/datasheet/FC-135%252032.7680KA-AG3/8245005.html; Supplier: LCSC; ConvertToPcb: yes; FootprintName: CRYSTAL-SMD_L3.2-W1.5-1; ModelName: CRYSTAL-SMD_L3.2-W1.5-1; Value: 32.768kHz; Frequency Stability: -; Operating Temperature: -40℃~+85℃